# EasyEDA schematic SCH_Aether Zero_R0.2.json
TITLE: Aether Zero; REV: 0.2; Date: 2023-12-19; Sheet: 1/1; Drawn By: averseabfun; Company: (none)
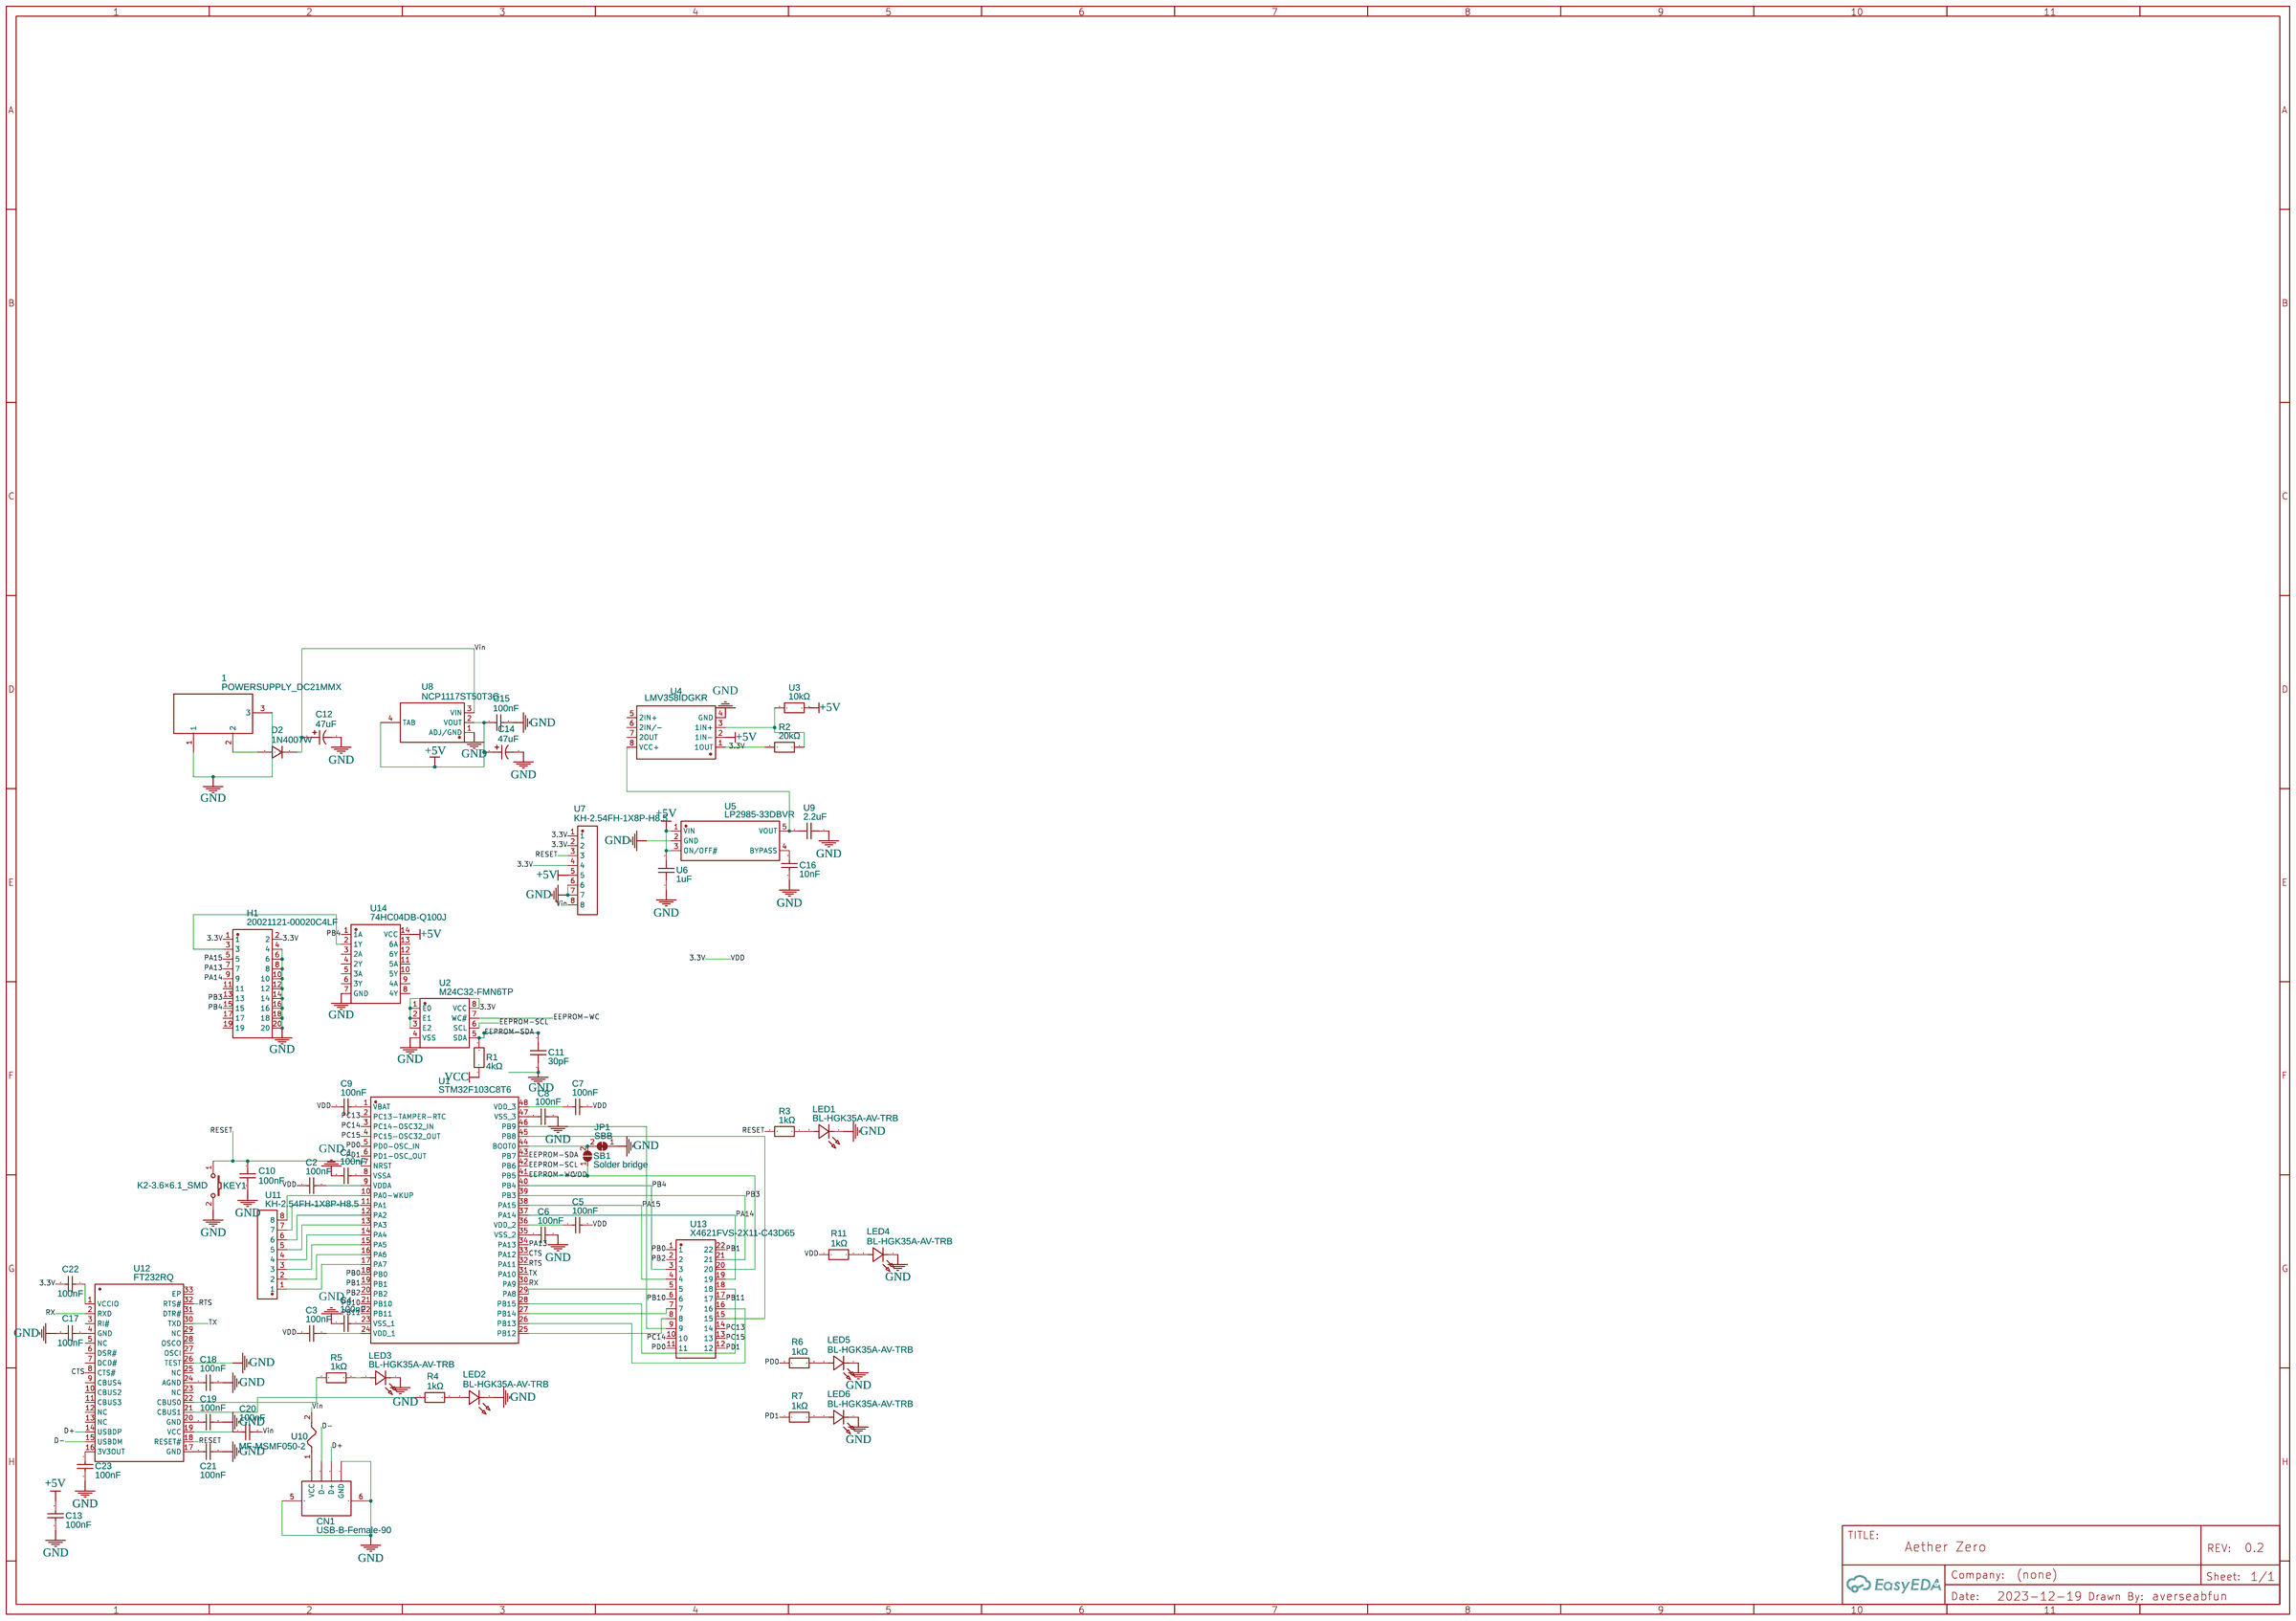
[diagram p0: schematic sheet]

## Parts
1  POWERSUPPLY_DC21MMX  [POWERSUPPLY_DC-21MM]
C1  100nF  [C0402]
C2  100nF  [C0402]
C3  100nF  [C0402]
C4  100nF  [C0402]
C5  100nF  [C0402]
C6  100nF  [C0402]
C7  100nF  [C0402]
C8  100nF  [C0402]
C9  100nF  [C0402]
C10  100nF  [C0402]
C11  30pF  [C0402]
C12  47uF  [CAP-SMD_BD6.3-L6.6-W6.6-LS7.2-FD]
C13  100nF  [C0402]
C14  47uF  [CAP-SMD_BD6.3-L6.6-W6.6-LS7.2-FD]
C15  100nF  [C0402]
C16  10nF  [C0402]
C17  100nF  [C0402]
C18  100nF  [C0402]
C19  100nF  [C0402]
C20  100nF  [C0402]
C21  100nF  [C0402]
C22  100nF  [C0402]
C23  100nF  [C0402]
CN1  USB-B-Female-90  [USB-B_TH_USB-B-FEMALE-90]
D2  1N4007W  [SOD-123_L2.8-W1.8-LS3.7-RD]
H1  20021121-00020C4LF  [HDR-SMD_20P-P1.27-V-M-R2-C10-S1.27-LS5.5-1]
JP1  SBB  [SOLDER BRIDGE 2P BRIDGED]
KEY1  K2-3.6×6.1_SMD  [KEY-SMD_2P-L6.2-W3.6-LS8.0]
LED1  BL-HGK35A-AV-TRB  [LED0805-RD_GREEN]
LED2  BL-HGK35A-AV-TRB  [LED0805-RD_GREEN]
LED3  BL-HGK35A-AV-TRB  [LED0805-RD_GREEN]
LED4  BL-HGK35A-AV-TRB  [LED0805-RD_GREEN]
LED5  BL-HGK35A-AV-TRB  [LED0805-RD_GREEN]
LED6  BL-HGK35A-AV-TRB  [LED0805-RD_GREEN]
R1  4kΩ  [R1206]
R2  20kΩ  [R0402]
R3  1kΩ  [R0603]
R4  1kΩ  [R0603]
R5  1kΩ  [R0603]
R6  1kΩ  [R0603]
R7  1kΩ  [R0603]
R11  1kΩ  [R0603]
SB1  Solder bridge  [SOLDER BRIDGE 2P UNBRIDGED]
U1  STM32F103C8T6  [LQFP-48_L7.0-W7.0-P0.50-LS9.0-BL]
U2  M24C32-FMN6TP  [SO-8_L4.9-W3.9-P1.27-LS6.0-BL]
U3  10kΩ  [R1206]
U4  LMV358IDGKR  [VSSOP-8_L3.0-W3.0-P0.65-LS5.0-BL]
U5  LP2985-33DBVR  [SOT-23-5_L2.9-W1.6-P0.95-LS2.8-TL]
U6  1uF  [C1206]
U7  KH-2.54FH-1X8P-H8.5  [HDR-TH_8P-P2.54-V-F]
U8  NCP1117ST50T3G  [SOT-223_L6.5-W3.5-P2.30-LS7.0-BR]
U9  2.2uF  [C0805]
U10  MF-MSMF050-2  [F1812]
U11  KH-2.54FH-1X8P-H8.5  [HDR-TH_8P-P2.54-V-F]
U12  FT232RQ  [QFN-32_L5.0-W5.0-P0.50-BL-EP]
U13  X4621FVS-2X11-C43D65  [CONN-SMD_X4621FVS-2X11-C43D65]
U14  74HC04DB-Q100J  [SSOP-14_L6.2-W5.3-P0.65-LS7.8-BL]

## Library data of the parts
1 = POWERSUPPLY_DC21MMX: Contributor: joserbraga
C1-C10 C13 C15 C17-C23 = 0402B104K160NT: Supplier: LCSC; Manufacturer: FH(风华); Supplier Part: C41851; JLCPCB Part Class: Extended Part; link: https://lcsc.com/eda_search?q=C41851&%26type=1&ref=editor
C11 = AC0402JRNPO9BN300: Contributor: LCSC; Supplier: LCSC; Supplier Part: C726127; Manufacturer: YAGEO(国巨); JLCPCB Part Class: Extended Part
C12 C14 = RVT47UF35V67RV0039: Contributor: LCSC; Supplier: LCSC; Supplier Part: C2836440; Manufacturer: KNSCHA(科尼盛); JLCPCB Part Class: Extended Part; link: https://lcsc.com/eda_search?q=C2836440&%26type=1&ref=editor
C16 = 0402B103K500NT: Supplier: LCSC; Manufacturer: FH(风华); Supplier Part: C1524; JLCPCB Part Class: Extended Part
CN1 = USB-B-Female-90: Supplier: LCSC; Manufacturer: 精拓金; Manufacturer Part: 921-111A1010D10200; Supplier Part: C46392; JLCPCB Part Class: Extended Part; link: https://lcsc.com/eda_search?q=C46392&%26type=1&ref=editor
D2 = 1N4007W: Supplier: LCSC; Supplier Part: C328592; Manufacturer: BLUE ROCKET; Contributor: LCEDA_Lib
H1 = 20021121-00020C4LF: Contributor: LCSC; Supplier: LCSC; Supplier Part: C239061; Manufacturer: Amphenol; JLCPCB Part Class: Extended Part
JP1 = SBB: Contributor: Giovanni Lenzi
KEY1 = K2-3.6×6.1_SMD: Supplier Part: C118141; Supplier: LCSC; Manufacturer Part: K2-1107ST-A4SW-06; Contributor: LCEDA_Lib; 制造商: 韩国韩荣
LED1-LED6 = BL-HGK35A-AV-TRB: Contributor: lcsc; Supplier: LCSC; Supplier Part: C5123492; Manufacturer: BrtLed(佰鸿); JLCPCB Part Class: Extended Part; link: https://lcsc.com/eda_search?q=C5123492&%26type=1&ref=editor
R1 = RN732BTTD4001B25: Contributor: LCSC; Supplier: LCSC; Supplier Part: C782230; Manufacturer: KOA; JLCPCB Part Class: Extended Part
R2 = RT0402BRD0720KL: Contributor: lcsc; Supplier: LCSC; Supplier Part: C705630; Manufacturer: YAGEO(国巨); JLCPCB Part Class: Extended Part
R3-R7 R11 = CR-03JA7----1K: Contributor: LCSC; Supplier: LCSC; Supplier Part: C881898; Manufacturer: Viking Tech; JLCPCB Part Class: Extended Part; link: https://lcsc.com/eda_search?q=C881898&%26type=1&ref=editor
SB1 = Solder bridge: Contributor: pipizl8981; Manufacturer Part: DNP; Manufacturer: DNP
U1 = STM32F103C8T6: Supplier: LCSC; Manufacturer: ST(意法半导体); Supplier Part: C8734; JLCPCB Part Class: Basic Part
U2 = M24C32-FMN6TP: Contributor: LCSC; Supplier: LCSC; Supplier Part: C2061453; Manufacturer: ST(意法半导体); JLCPCB Part Class: Extended Part
U3 = TC0625B1002T5J: Contributor: lcsc; Supplier: LCSC; Supplier Part: C2989106; Manufacturer: UNI-ROYAL(厚声); JLCPCB Part Class: Extended Part
U4 = LMV358IDGKR: Supplier: LCSC; Manufacturer: TI(德州仪器); Supplier Part: C105242; JLCPCB Part Class: Extended Part; link: https://lcsc.com/eda_search?q=C105242&%26type=1&ref=editor
U5 = LP2985-33DBVR: Supplier: LCSC; Manufacturer: TI(德州仪器); Supplier Part: C95414; JLCPCB Part Class: Extended Part; link: https://lcsc.com/eda_search?q=C95414&%26type=1&ref=editor
U6 = CGA5L3X8R1H105KT0Y0N: Contributor: lcsc; Supplier: LCSC; Supplier Part: C342628; Manufacturer: TDK; JLCPCB Part Class: Extended Part
U7 U11 = KH-2.54FH-1X8P-H8.5: Contributor: LCSC; Supplier: LCSC; Supplier Part: C2905417; Manufacturer: kinghelm(金航标); JLCPCB Part Class: Extended Part; link: https://lcsc.com/eda_search?q=C2905417&%26type=1&ref=editor
U8 = NCP1117ST50T3G: Supplier: LCSC; Manufacturer: onsemi(安森美); Supplier Part: C17314; JLCPCB Part Class: Extended Part; link: https://lcsc.com/eda_search?q=C17314&%26type=1&ref=editor
U9 = 0805X225K250CT_C5122273: Contributor: lcsc; Supplier: LCSC; Supplier Part: C5122273; Manufacturer: Walsin(华新科); Manufacturer Part: 0805X225K250CT; JLCPCB Part Class: Extended Part
U10 = MF-MSMF050-2: Supplier: LCSC; Manufacturer: BOURNS; Supplier Part: C17313; JLCPCB Part Class: Extended Part; link: https://lcsc.com/eda_search?q=C17313&%26type=1&ref=editor
U12 = FT232RQ: Contributor: SparkFun; Supplier: LCSC; Manufacturer: FTDI(飞特帝亚); Manufacturer Part: FT232RQ-REEL; Supplier Part: C14090; JLCPCB Part Class: Extended Part
U13 = X4621FVS-2X11-C43D65: Contributor: LCSC; Supplier: LCSC; Supplier Part: C2883198; Manufacturer: XKB Connectivity(中国星坤); Manufacturer Part: X4621FVS-2x11-C43D65; JLCPCB Part Class: Extended Part
U14 = 74HC04DB-Q100J: Contributor: LCSC; Supplier: LCSC; Supplier Part: C546498; Manufacturer: Nexperia(安世); JLCPCB Part Class: Extended Part

## Nets
3.3V: C2.2 C3.2 C5.2 C7.2 C9.2 C22.2 H1.1 H1.2 R2.1 R11.1 SB1.1(A) U1.41(PB5) U2.1(E0) U2.2(E1) U2.3(E2) U2.7(WC#) U2.8(VCC) U4.1(1OUT) U7.1 U7.2 U7.4 U13.20
+5V: C13.2 C14.1 C15.1 U3.2 U4.2(1IN-) U5.1(VIN) U5.3(ON/OFF#) U6.2 U7.5 U8.2(VOUT) U8.4(TAB) U14.14(VCC)
GND: 1.1 1.3 C1.2 C4.2 C6.2 C8.2 C10.2 C11.2 C12.2 C13.1 C14.2 C15.2 C16.1 C17.2 C18.2 C19.2 C21.2 C23.2 CN1.4(GND) CN1.5(SH1) CN1.6(SH2) H1.4 H1.6 H1.8 H1.10 H1.12 H1.14 H1.16 H1.18 H1.20 JP1.1(A) KEY1.2 LED1.1(K) LED2.1(K) LED3.1(K) LED4.1(K) LED5.1(K) LED6.1(K) U2.4(VSS) U4.4(GND) U5.2(GND) U6.1 U7.6 U7.7 U8.1(ADJ/GND) U9.1 U12.26(TEST) U14.7(GND)
VCC: R1.1
Vin: C12.1 C20.2 D2.1 U7.8 U8.3(VIN) U10.2
CTS: U1.33(PA12) U12.8(CTS#)
D+: CN1.3(D+) U12.14(USBDP)
D-: CN1.2(D-) U12.15(USBDM)
EEPROM-SCL: U1.42(PB6) U2.6(SCL)
EEPROM-SDA: C11.1 R1.2 U1.43(PB7) U2.5(SDA)
PA13: H1.7 U1.34(PA13)
PA14: H1.9 U1.37(PA14) U13.19
PA15: H1.5 U1.38(PA15) U13.4
PB0: U1.18(PB0) U13.1
PB1: U1.19(PB1) U13.22
PB2: U1.20(PB2) U13.2
PB3: H1.13 U1.39(PB3) U13.21
PB4: H1.15 U1.40(PB4) U13.3 U14.1(1A)
PB10: U1.21(PB10) U13.6
PB11: U1.22(PB11) U13.17
PC13: U1.2(PC13-TAMPER-RTC) U13.14
PC14: U1.3(PC14-OSC32_IN) U13.10
PC15: U1.4(PC15-OSC32_OUT) U13.13
PD0: R6.1 U1.5(PD0-OSC_IN) U13.11
PD1: R7.1 U1.6(PD1-OSC_OUT) U13.12
RESET: C10.1 KEY1.1 R3.2 U1.7(NRST) U7.3 U12.18(RESET#)
RTS: U1.32(PA11) U12.32(RTS#)
RX: U1.30(PA9) U12.2(RXD)
TX: U1.31(PA10) U12.30(TXD)
Net-(1-2): 1.2 D2.2
Net-(C1-1): C1.1 U1.8(VSSA)
Net-(C2-1): C2.1 U1.9(VDDA)
Net-(C3-1): C3.1 U1.24(VDD_1)
Net-(C4-1): C4.1 U1.23(VSS_1)
Net-(C5-1): C5.1 U1.36(VDD_2)
Net-(C6-1): C6.1 U1.35(VSS_2)
Net-(C7-1): C7.1 U1.48(VDD_3)
Net-(C8-1): C8.1 U1.47(VSS_3)
Net-(C9-1): C9.1 U1.1(VBAT)
Net-(C16-2): C16.2 U5.4(BYPASS)
Net-(C17-1): C17.1 U12.4(GND)
Net-(C18-1): C18.1 U12.24(AGND)
Net-(C19-1): C19.1 U12.20(GND)
Net-(C20-1): C20.1 U12.19(VCC)
Net-(C21-1): C21.1 U12.17(GND)
Net-(C22-1): C22.1 U12.1(VCCIO)
Net-(C23-1): C23.1 U12.16(3V3OUT)
Net-(CN1-1): CN1.1(VCC) U10.1
Net-(H1-3): H1.3 U14.2(1Y)
Net-(JP1-2): JP1.2(B) SB1.2(B) U1.44(BOOT0)
Net-(LED1-2): LED1.2(A) R3.1
Net-(LED2-2): LED2.2(A) R4.2
Net-(LED3-2): LED3.2(A) R5.1
Net-(LED4-2): LED4.2(A) R11.2
Net-(LED5-2): LED5.2(A) R6.2
Net-(LED6-2): LED6.2(A) R7.2
Net-(R2-2): R2.2 U3.1 U4.3(1IN+)
Net-(R4-1): R4.1 U12.21(CBUS1)
Net-(R5-2): R5.2 U12.22(CBUS0)
Net-(U1-10): U1.10(PA0-WKUP) U11.8
Net-(U1-11): U1.11(PA1) U11.7
Net-(U1-12): U1.12(PA2) U11.6
Net-(U1-13): U1.13(PA3) U11.5
Net-(U1-14): U1.14(PA4) U11.4
Net-(U1-15): U1.15(PA5) U11.3
Net-(U1-16): U1.16(PA6) U11.2
Net-(U1-17): U1.17(PA7) U11.1
Net-(U1-25): U1.25(PB12) U13.8
Net-(U1-26): U1.26(PB13) U13.16
Net-(U1-27): U1.27(PB14) U13.7
Net-(U1-28): U1.28(PB15) U13.18
Net-(U1-29): U1.29(PA8) U13.5
Net-(U1-45): U1.45(PB8) U13.15
Net-(U1-46): U1.46(PB9) U13.9
Net-(U4-8): U4.8(VCC+) U5.5(VOUT) U9.2

Not connected (* = marked no-connect by the designer): H1 11 17 19; U4 5(2IN+) 6(2IN/-) 7(2OUT); U12 3(RI#) 5(NC) 6(DSR#) 7(DCD#) 9(CBUS4) 10(CBUS2) 11(CBUS3) 12(NC) 13(NC) 23(NC) 25(NC) 27(OSCI) 28(OSCO) 29(NC) 31(DTR#) 33(EP); U14 3(2A) 4(2Y) 5(3A) 6(3Y) 8(4Y) 9(4A) 10(5Y) 11(5A) 12(6Y) 13(6A)
